# EAGLE design DELA_Speed_1541C_Clone (EAGLE 6.4)
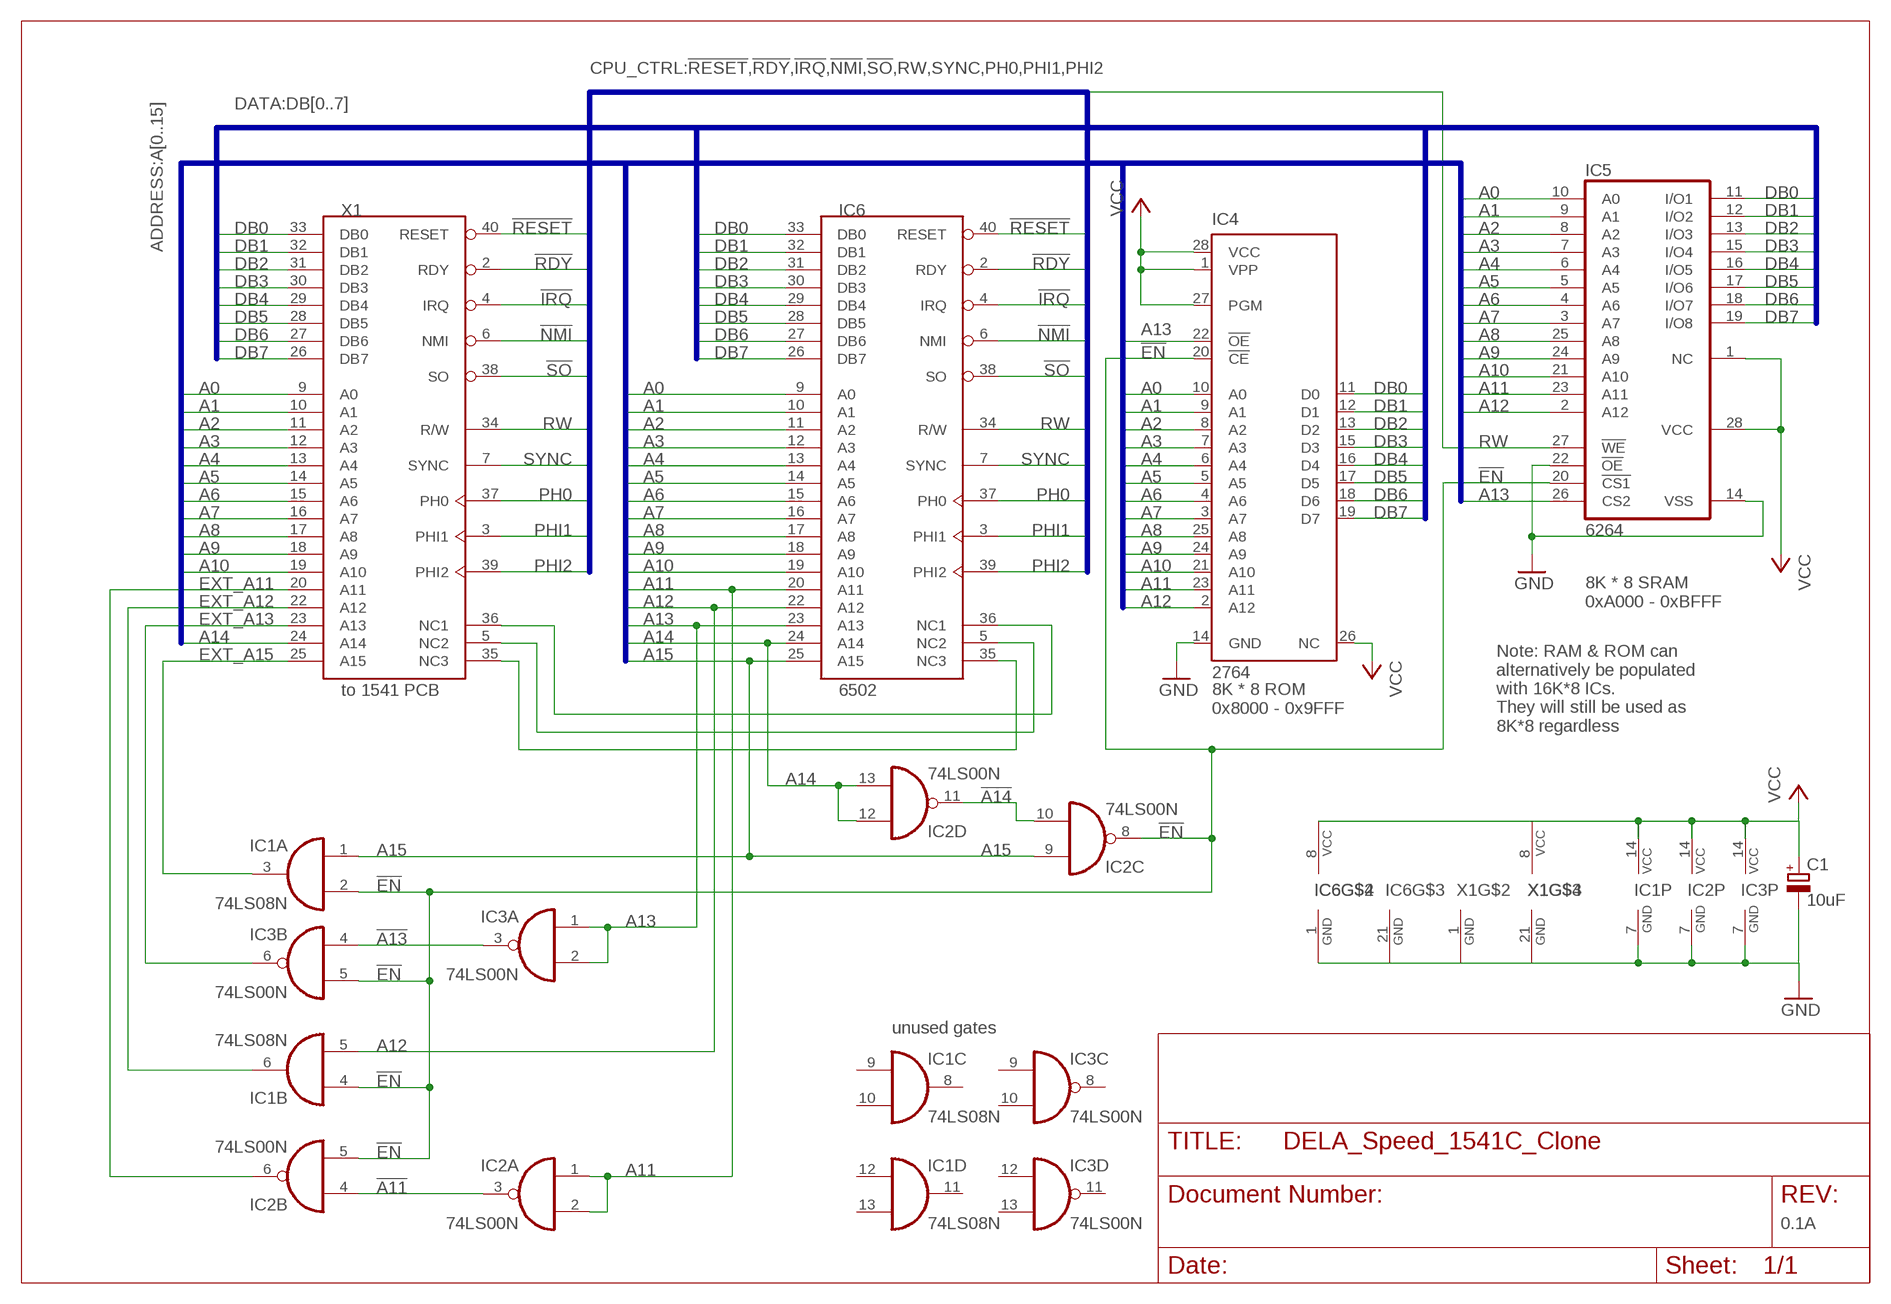
[diagram p0: schematic, sheet 1]

## Parts
C1  10uF  CPOL-EUE2.5-6  [E2,5-6]
IC1  74LS08N  [DIL14]
IC2  74LS00N  [DIL14]
IC3  74LS00N  [DIL14]
IC4  2764  27C64P  [DIL28-6]
IC5  6264  6264A  [DIL28-6]
IC6  6502  [DIP40]
X1  to 1541 PCB  6502  [DIP40]

## Nets
!A11: IC2.3(A:O) IC2.4(B:I0)
!A13: IC3.3(A:O) IC3.4(B:I0)
!A14: IC2.10(C:I1) IC2.11(D:O)
!EN: IC1.2(A:I1) IC1.4(B:I0) IC2.5(B:I1) IC2.8(C:O) IC3.5(B:I1) IC4.20(!CE) IC5.20(!CS1)
!IRQ: IC6.4(IRQ) X1.4(IRQ)
!NMI: IC6.6(NMI) X1.6(NMI)
!RDY: IC6.2(RDY) X1.2(RDY)
!RESET: IC6.40(RESET) X1.40(RESET)
!SO: IC6.38(SO) X1.38(SO)
A0: IC4.10(A0) IC5.10(A0) IC6.9(A0) X1.9(A0)
A1: IC4.9(A1) IC5.9(A1) IC6.10(A1) X1.10(A1)
A2: IC4.8(A2) IC5.8(A2) IC6.11(A2) X1.11(A2)
A3: IC4.7(A3) IC5.7(A3) IC6.12(A3) X1.12(A3)
A4: IC4.6(A4) IC5.6(A4) IC6.13(A4) X1.13(A4)
A5: IC4.5(A5) IC5.5(A5) IC6.14(A5) X1.14(A5)
A6: IC4.4(A6) IC5.4(A6) IC6.15(A6) X1.15(A6)
A7: IC4.3(A7) IC5.3(A7) IC6.16(A7) X1.16(A7)
A8: IC4.25(A8) IC5.25(A8) IC6.17(A8) X1.17(A8)
A9: IC4.24(A9) IC5.24(A9) IC6.18(A9) X1.18(A9)
A10: IC4.21(A10) IC5.21(A10) IC6.19(A10) X1.19(A10)
A11: IC2.1(A:I0) IC2.2(A:I1) IC4.23(A11) IC5.23(A11) IC6.20(A11)
A12: IC1.5(B:I1) IC4.2(A12) IC5.2(A12) IC6.22(A12)
A13: IC3.1(A:I0) IC3.2(A:I1) IC4.22(!OE) IC5.26(CS2) IC6.23(A13)
A14: IC2.12(D:I0) IC2.13(D:I1) IC6.24(A14) X1.24(A14)
A15: IC1.1(A:I0) IC2.9(C:I0) IC6.25(A15)
DB0: IC4.11(D0) IC5.11(I/O1) IC6.33(DB0) X1.33(DB0)
DB1: IC4.12(D1) IC5.12(I/O2) IC6.32(DB1) X1.32(DB1)
DB2: IC4.13(D2) IC5.13(I/O3) IC6.31(DB2) X1.31(DB2)
DB3: IC4.15(D3) IC5.15(I/O4) IC6.30(DB3) X1.30(DB3)
DB4: IC4.16(D4) IC5.16(I/O5) IC6.29(DB4) X1.29(DB4)
DB5: IC4.17(D5) IC5.17(I/O6) IC6.28(DB5) X1.28(DB5)
DB6: IC4.18(D6) IC5.18(I/O7) IC6.27(DB6) X1.27(DB6)
DB7: IC4.19(D7) IC5.19(I/O8) IC6.26(DB7) X1.26(DB7)
EXT_A11: IC2.6(B:O) X1.20(A11)
EXT_A12: IC1.6(B:O) X1.22(A12)
EXT_A13: IC3.6(B:O) X1.23(A13)
EXT_A15: IC1.3(A:O) X1.25(A15)
GND: C1.- IC1.7(P:GND) IC2.7(P:GND) IC3.7(P:GND) IC4.14(GND) IC5.14(VSS) IC5.22(!OE) IC6.1(GND) IC6.21(GND) X1.1(GND) X1.21(GND)
NC1: IC6.36(NC1) X1.36(NC1)
NC2: IC6.5(NC2) X1.5(NC2)
NC3: IC6.35(NC3) X1.35(NC3)
PH0: IC6.37(PH0) X1.37(PH0)
PHI1: IC6.3(PHI1) X1.3(PHI1)
PHI2: IC6.39(PHI2) X1.39(PHI2)
RW: IC5.27(!WE) IC6.34(R/W) X1.34(R/W)
SYNC: IC6.7(SYNC) X1.7(SYNC)
VCC: C1.+ IC1.14(P:VCC) IC2.14(P:VCC) IC3.14(P:VCC) IC4.1(VPP) IC4.26(NC) IC4.27(PGM) IC4.28(VCC) IC5.1(NC) IC5.28(VCC) IC6.8(VCC) X1.8(VCC)
Unconnected: IC1.8(C:O) IC1.9(C:I0) IC1.10(C:I1) IC1.11(D:O) IC1.12(D:I0) IC1.13(D:I1) IC3.8(C:O) IC3.9(C:I0) IC3.10(C:I1) IC3.11(D:O) IC3.12(D:I0) IC3.13(D:I1)

## Buses
ADDRESS:A[0..15]
DATA:DB[0..7]
CPU_CTRL:!RESET,!RDY,!IRQ,!NMI,!SO,RW,SYNC,PH0,PHI1,PHI2

## Notes on the sheet
- 8K * 8 SRAM
  0xA000 - 0xBFFF
- 8K * 8 ROM
  0x8000 - 0x9FFF
- Note: RAM & ROM can 
  alternatively be populated 
  with 16K*8 ICs.
  They will still be used as 
  8K*8 regardless
- unused gates
- 0.1A

## Library data of the parts
C1 = rcl:CPOL-EU: POLARIZED CAPACITOR, European symbol
IC1 = 74xx-eu:74*08: Quad 2-input AND gate
IC2 IC3 = 74xx-eu:74*00: Quad 2-input NAND gate
IC4 = microchip:27*64: CMOS EPROM 64 K (8 K x 8), low voltage; MF: Arrow Electronics; MPN: M27C64A-10F1; OC_FARNELL: 1094265; OC_NEWARK: 93K7339
IC5 = memory-hitachi:6264A: MEMORY; OC_FARNELL: 283605; OC_NEWARK: unknown
IC6 X1 = 0RB_65xx:6502

## Board
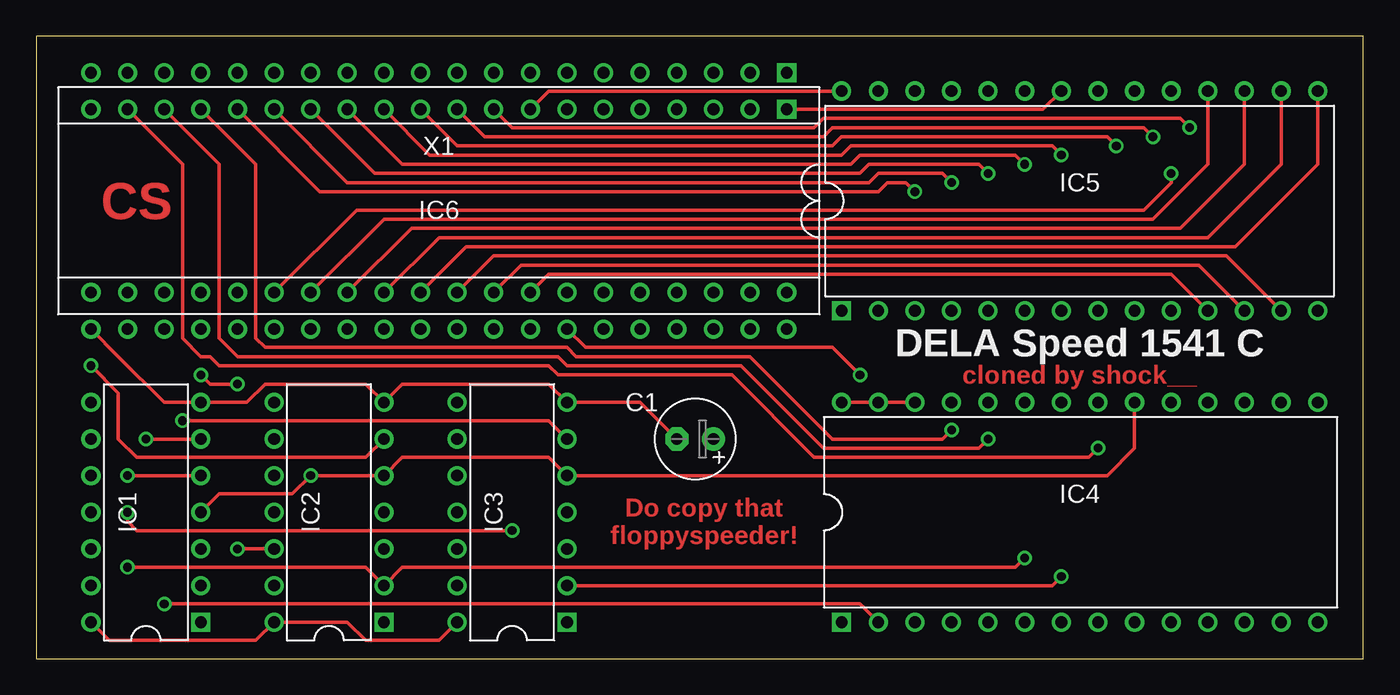
[diagram p1: board, top side]
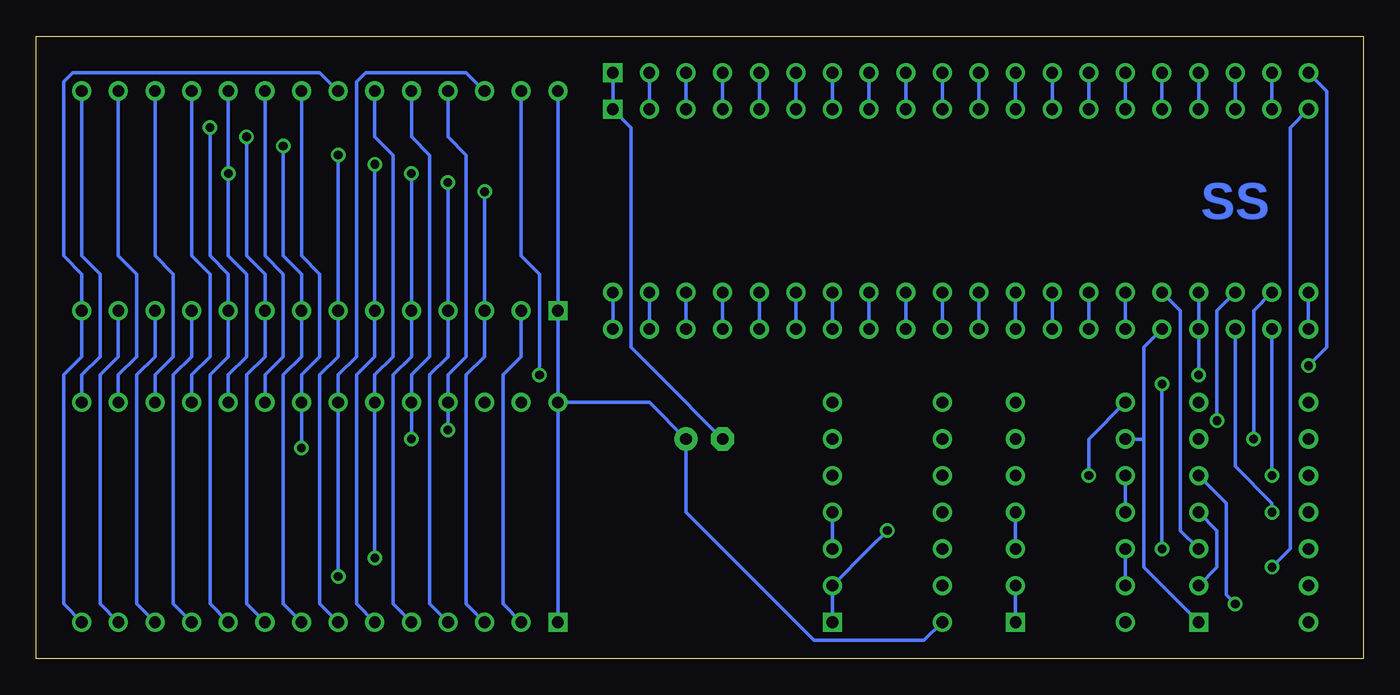
[diagram p2: board, bottom side, seen from below]

Size 92.08 x 43.18 mm. Coordinates in mm from the lower left corner, seen from the top.
Outline: 0,0 92.08,0 92.08,43.18 0,43.18 0,0
Copper layers (1*16): Top 0.035mm / dielectric 1.5mm / Bottom 0.035mm
Design rules "default *": minimum track width 10mil, minimum drill 24mil, track to track 8mil, track to pad 8mil, pad to pad 8mil, via to via 8mil, smd to smd 8mil, copper to edge 40mil, drill to drill 8mil, minimum pad ring 10mil, minimum via ring 8mil, stop-mask expansion 4mil, vias tented up to drill 40mil, thermal gap 10mil

### Footprints (pad centres in the part's own frame; a part is rotated, then mirrored left to right if it is on the bottom)
E2,5-6 = drill 0.813 pad 1.6: + -1.27,0 | drill 0.813 pad 1.6 octagon: - 1.27,0
DIL14 = drill 0.813 square: 1 -7.62,-3.81 | drill 0.813: 2 -5.08,-3.81; 3 -2.54,-3.81; 4 0,-3.81; 5 2.54,-3.81; 6 5.08,-3.81; 7 7.62,-3.81; 8 7.62,3.81; 9 5.08,3.81; 10 2.54,3.81; 11 0,3.81; 12 -2.54,3.81; 13 -5.08,3.81; 14 -7.62,3.81
DIL28-6 = drill 0.813 square: 1 -16.51,-7.62 | drill 0.813: 2 -13.97,-7.62; 3 -11.43,-7.62; 4 -8.89,-7.62; 5 -6.35,-7.62; 6 -3.81,-7.62; 7 -1.27,-7.62; 8 1.27,-7.62; 9 3.81,-7.62; 10 6.35,-7.62; 11 8.89,-7.62; 12 11.43,-7.62; 13 13.97,-7.62; 14 16.51,-7.62; 15 16.51,7.62; 16 13.97,7.62; 17 11.43,7.62; 18 8.89,7.62; 19 6.35,7.62; 20 3.81,7.62; 21 1.27,7.62; 22 -1.27,7.62; 23 -3.81,7.62; 24 -6.35,7.62; 25 -8.89,7.62; 26 -11.43,7.62; 27 -13.97,7.62; 28 -16.51,7.62
DIP40 = drill 0.813 pad 1.27 square: 1 -24.13,-7.62 | drill 0.813 pad 1.27: 2 -21.59,-7.62; 3 -19.05,-7.62; 4 -16.51,-7.62; 5 -13.97,-7.62; 6 -11.43,-7.62; 7 -8.89,-7.62; 8 -6.35,-7.62; 9 -3.81,-7.62; 10 -1.27,-7.62; 11 1.27,-7.62; 12 3.81,-7.62; 13 6.35,-7.62; 14 8.89,-7.62; 15 11.43,-7.62; 16 13.97,-7.62; 17 16.51,-7.62; 18 19.05,-7.62; 19 21.59,-7.62; 20 24.13,-7.62; 21 24.13,7.62; 22 21.59,7.62; 23 19.05,7.62; 24 16.51,7.62; 25 13.97,7.62; 26 11.43,7.62; 27 8.89,7.62; 28 6.35,7.62; 29 3.81,7.62; 30 1.27,7.62; 31 -1.27,7.62; 32 -3.81,7.62; 33 -6.35,7.62; 34 -8.89,7.62; 35 -11.43,7.62; 36 -13.97,7.62; 37 -16.51,7.62; 38 -19.05,7.62; 39 -21.59,7.62; 40 -24.13,7.62

### Placement (x,y rotation side)
C1  45.72,15.24 180 top
IC1  7.62,10.16 90 top
IC2  20.32,10.16 90 top
IC3  33.02,10.16 90 top
IC4  72.39,10.16 0 top
IC5  72.39,31.75 0 top
IC6  27.94,30.48 180 top
X1  27.94,33.02 180 top

### Tracks (layer width: path | path; a pad name or v marks a point on that pad's centre or on a via)
!A11
  Bottom 0.254: IC2.3 IC2.4
!A13
  Bottom 0.254: IC3.3 IC3.4
!A14
  Bottom 0.254: IC2.10 IC2.11
!EN  (via drill 0.6)
  Top 0.254: IC1.4 12.7,11.43 17.78,11.43 v19.05,12.7 IC2.5 25.4,13.97 35.56,13.97 IC3.5 37.47,12.7 38.73,12.7 71.12,12.7 74.3,12.7 76.2,14.61 IC4.20
  Bottom 0.254: IC5.20 76.2,27.94 74.93,26.67 74.93,20.95 76.2,19.68 IC4.20 | 10.16,8.89 IC1.4 10.16,8.89 | 10.16,8.89 10.16,6.35 | 10.16,6.35 IC1.2 10.16,6.35 | v19.05,12.7 19.05,15.24 IC2.8 | 10.16,6.35 10.16,8.89
!IRQ
  Bottom 0.254: X1.4 IC6.4
!NMI
  Bottom 0.254: X1.6 IC6.6
!RDY
  Bottom 0.254: X1.2 IC6.2
!RESET
  Bottom 0.254: X1.40 IC6.40
!SO
  Bottom 0.254: X1.38 IC6.38
A0  (via drill 0.6)
  Top 0.254: IC6.9 33.02,36.83 53.34,36.83 53.98,36.83 54.61,37.47 79.38,37.47 v80.01,36.83
  Bottom 0.254: X1.9 IC6.9 | v80.01,36.83 80.01,27.94 78.74,26.67 IC5.10 78.74,20.95 80.01,19.68 80.01,3.81 IC4.10
A1  (via drill 0.6)
  Top 0.254: IC6.10 31.11,36.2 53.98,36.2 54.61,36.2 55.24,36.83 76.83,36.83 v77.47,36.2
  Bottom 0.254: X1.10 IC6.10 | v77.47,36.2 77.47,27.94 76.2,26.67 IC5.9 76.2,20.95 77.47,19.68 77.47,3.81 IC4.9
A2  (via drill 0.6)
  Top 0.254: IC6.11 29.21,35.56 55.24,35.56 55.88,36.2 74.3,36.2 v74.93,35.56
  Bottom 0.254: X1.11 IC6.11 | v74.93,35.56 74.93,27.94 73.66,26.67 IC5.8 73.66,20.95 74.93,19.68 74.93,3.81 IC4.8
A3  (via drill 0.6)
  Top 0.254: IC6.12 27.3,34.92 55.88,34.92 56.52,35.56 70.48,35.56 v71.12,34.92
  Bottom 0.254: X1.12 IC6.12 | v71.12,34.92 71.12,27.94 71.12,26.67 IC5.7 71.12,20.95 72.39,19.68 72.39,3.81 IC4.7
A4  (via drill 0.6)
  Top 0.254: IC6.13 25.4,34.29 56.52,34.29 57.15,34.92 67.94,34.92 v68.58,34.29
  Bottom 0.254: X1.13 IC6.13 | v68.58,34.29 IC5.6 68.58,20.95 69.85,19.68 69.85,3.81 IC4.6
A5  (via drill 0.6)
  Top 0.254: IC6.14 23.5,33.66 57.15,33.66 57.78,34.29 65.41,34.29 v66.04,33.66
  Bottom 0.254: X1.14 IC6.14 | v66.04,33.66 IC5.5 66.04,20.95 67.31,19.68 67.31,3.81 IC4.5
A6  (via drill 0.6)
  Top 0.254: IC6.15 21.59,33.02 57.78,33.02 58.42,33.66 62.87,33.66 v63.5,33.02
  Bottom 0.254: X1.15 IC6.15 | v63.5,33.02 IC5.4 63.5,20.95 64.77,19.68 64.77,3.81 IC4.4
A7  (via drill 0.6)
  Top 0.254: IC6.16 19.68,32.38 58.42,32.38 59.05,33.02 60.33,33.02 v60.96,32.38
  Bottom 0.254: X1.16 IC6.16 | v60.96,32.38 IC5.3 60.96,20.95 62.23,19.68 62.23,3.81 IC4.3
A8  (via drill 0.6)
  Top 0.254: IC6.17 14.61,34.92 15.24,34.29 15.24,22.23 15.88,21.59 36.83,21.59 37.47,20.95 49.53,20.95 52.07,18.41 55.24,15.24 62.87,15.24 v63.5,15.88
  Bottom 0.254: X1.17 IC6.17 | IC5.25 63.5,36.2 62.23,34.92 62.23,22.23 62.23,20.95 63.5,19.68 IC4.25 v63.5,15.88
A9  (via drill 0.6)
  Top 0.254: IC6.18 12.7,34.29 12.7,22.23 13.34,21.59 13.97,20.95 36.2,20.95 36.83,20.32 48.9,20.32 54.61,14.61 65.41,14.61 v66.04,15.24
  Bottom 0.254: X1.18 IC6.18 | IC5.24 66.04,36.2 64.77,34.92 64.77,22.23 64.77,20.95 66.04,19.68 IC4.24 v66.04,15.24
A10  (via drill 0.6)
  Top 0.254: IC6.19 10.16,34.29 10.16,22.23 11.43,20.95 12.06,20.95 12.7,20.32 35.56,20.32 36.2,19.68 48.26,19.68 53.98,13.97 73.03,13.97 v73.66,14.61
  Bottom 0.254: X1.19 IC6.19 | IC5.21 73.66,27.94 72.39,26.67 72.39,22.23 72.39,20.95 73.66,19.68 IC4.21 v73.66,14.61
A11  (via drill 0.6)
  Top 0.254: v6.35,6.35 22.86,6.35 IC2.2 25.4,6.35 67.94,6.35 v68.58,6.99
  Bottom 0.254: IC5.23 68.58,36.2 67.31,34.92 67.31,20.95 68.58,19.68 IC4.23 v68.58,6.99 | IC6.20 5.08,36.83 5.08,7.62 v6.35,6.35 | IC2.2 IC2.1
A12  (via drill 0.6)
  Top 0.254: v8.89,3.81 57.15,3.81 IC4.2 | v6.35,12.7 IC1.5
  Bottom 0.254: v8.89,3.81 9.53,4.45 9.53,10.79 IC1.5 | IC6.22 v6.35,12.7 | IC4.2 59.69,3.81 59.69,19.68 58.42,20.95 IC5.2
A13  (via drill 0.6)
  Top 0.254: IC3.2 70.48,5.08 v71.12,5.71 | v6.35,10.16 6.35,9.53 6.99,8.89 v33.02,8.89
  Bottom 0.254: IC5.26 62.23,40.64 69.22,40.64 69.85,40.01 69.85,20.95 71.12,19.68 IC4.22 v71.12,5.71 | IC3.1 IC3.2 34.29,7.62 v33.02,8.89 | IC6.23 8.89,13.34 6.35,10.79 v6.35,10.16
A14  (via drill 0.6)
  Top 0.254: v13.97,7.62 IC2.12 | v13.97,19.05 12.06,19.05 v11.43,19.68
  Bottom 0.254: X1.24 IC6.24 11.43,20.32 v11.43,19.68 | IC2.12 IC2.13 | v13.97,19.05 v13.97,7.62
A15
  Bottom 0.254: IC6.25 15.24,21.59 15.24,15.24 | 15.24,15.24 IC2.9 | 15.24,15.24 15.24,6.35 IC1.1
DB0
  Top 0.254: X1.33 35.56,26.67 78.74,26.67 IC5.11
  Bottom 0.254: IC5.11 81.28,20.95 82.55,19.68 82.55,3.81 IC4.11 | X1.33 IC6.33 X1.33
DB1
  Top 0.254: X1.32 33.66,27.3 80.64,27.3 IC5.12
  Bottom 0.254: IC5.12 83.82,20.95 85.09,19.68 85.09,3.81 IC4.12 | X1.32 IC6.32 X1.32
DB2
  Top 0.254: X1.31 31.75,27.94 82.55,27.94 IC5.13
  Bottom 0.254: IC5.13 86.36,20.95 87.63,19.68 87.63,3.81 IC4.13 | X1.31 IC6.31 X1.31
DB3
  Top 0.254: X1.30 29.84,28.57 83.19,28.57 88.9,34.29 IC5.15
  Bottom 0.254: IC5.15 88.9,27.94 87.63,26.67 87.63,20.95 88.9,19.68 IC4.15 | X1.30 IC6.30 X1.30
DB4
  Top 0.254: X1.29 27.94,29.21 81.28,29.21 86.36,34.29 IC5.16
  Bottom 0.254: IC5.16 86.36,27.94 85.09,26.67 85.09,20.95 86.36,19.68 IC4.16 | X1.29 IC6.29 X1.29
DB5
  Top 0.254: X1.28 26.04,29.84 79.38,29.84 83.82,34.29 IC5.17
  Bottom 0.254: IC5.17 83.82,27.94 82.55,26.67 82.55,20.95 83.82,19.68 IC4.17 | X1.28 IC6.28 X1.28
DB6
  Top 0.254: X1.27 24.13,30.48 77.47,30.48 81.28,34.29 IC5.18
  Bottom 0.254: IC5.18 81.28,27.94 80.01,26.67 80.01,20.95 81.28,19.68 IC4.18 | X1.27 IC6.27 X1.27
DB7  (via drill 0.6)
  Top 0.254: X1.26 22.23,31.11 76.83,31.11 78.74,33.02 v78.74,33.66
  Bottom 0.254: IC5.19 v78.74,33.66 78.74,27.94 77.47,26.67 77.47,20.95 78.74,19.68 IC4.19 | X1.26 IC6.26 X1.26
EXT_A11  (via drill 0.6)
  Top 0.254: IC2.6 22.86,13.97 6.99,13.97 5.71,15.24 5.71,18.41 v3.81,20.32
  Bottom 0.254: X1.20 2.54,39.37 2.54,21.59 v3.81,20.32
EXT_A12  (via drill 0.6)
  Top 0.254: v7.62,15.24 IC1.6
  Bottom 0.254: X1.22 7.62,24.13 v7.62,15.24
EXT_A13  (via drill 0.6)
  Top 0.254: v10.16,16.51 35.56,16.51 IC3.6
  Bottom 0.254: X1.23 10.16,24.13 10.16,20.32 10.16,19.05 v10.16,16.51
EXT_A15
  Bottom 0.254: IC1.3 12.7,8.89 12.7,15.88 12.7,17.14 12.7,20.32 12.7,21.59 12.7,24.13 X1.25
GND
  Top 0.254: IC6.1 69.85,38.1 IC5.22 | IC6.21 5.71,20.95 8.89,17.78 IC1.7 14.61,17.78 15.88,19.05 22.86,19.05 IC2.7 25.4,19.05 35.56,19.05 IC3.7 41.91,17.78 C1.-
  Bottom 0.254: X1.1 IC6.1 50.8,36.83 50.8,21.59 48.9,19.68 C1.- | X1.21 IC6.21 | IC5.22 72.39,40.64 89.53,40.64 90.17,40.01 90.17,27.94 88.9,26.67 IC5.14 88.9,20.95 90.17,19.68 90.17,3.81 IC4.14
NC1
  Bottom 0.254: X1.36 IC6.36
NC2
  Bottom 0.254: X1.5 IC6.5
NC3
  Bottom 0.254: X1.35 IC6.35
PH0
  Bottom 0.254: X1.37 IC6.37
PHI1
  Bottom 0.254: X1.3 IC6.3
PHI2
  Bottom 0.254: X1.39 IC6.39
RW  (via drill 0.6)
  Top 0.254: IC6.34 38.1,21.59 55.24,21.59 v57.15,19.68
  Bottom 0.254: IC5.27 58.42,27.94 57.15,26.67 v57.15,19.68 | X1.34 IC6.34 X1.34
SYNC
  Bottom 0.254: X1.7 IC6.7
VCC
  Top 0.254: IC6.8 35.56,39.37 IC5.28 | IC4.26 IC4.27 IC4.28 | IC3.14 27.94,1.27 22.86,1.27 21.59,2.54 IC2.14 15.24,1.27 5.08,1.27 IC1.14
  Bottom 0.254: X1.8 IC6.8 | IC5.28 IC5.1 IC4.28 | IC4.28 IC4.1 | IC3.14 30.48,1.27 38.1,1.27 46.99,10.16 C1.+ 49.53,17.78 51.44,17.78 IC4.28

### Text on the board
Top: CS | cloned by shock__ | Do copy that / floppyspeeder!
Bottom: SS
tPlace: DELA Speed 1541 C